# Altium schematic sheet martix_connect_2.SchDoc
size A4 portrait
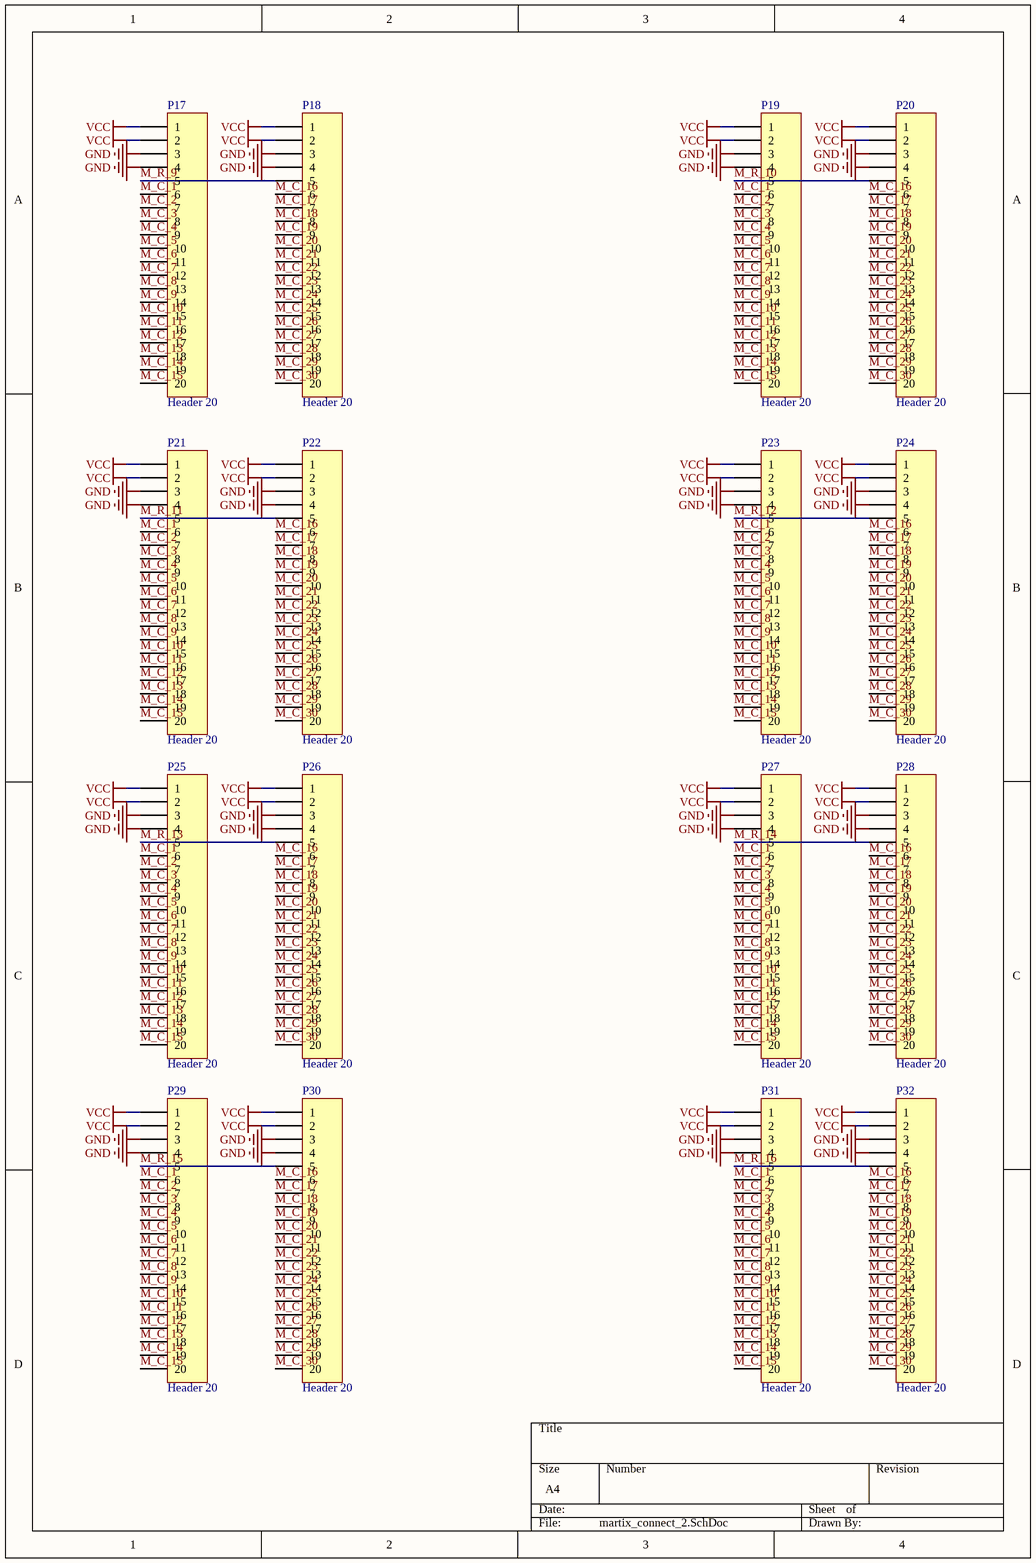
[diagram p0: martix_connect_2.SchDoc]

## Parts
P17  Header 20  [FPC0.5 2H-WS-20P]
P18  Header 20  [FPC0.5 2H-WS-20P]
P19  Header 20  [FPC0.5 2H-WS-20P]
P20  Header 20  [FPC0.5 2H-WS-20P]
P21  Header 20  [FPC0.5 2H-WS-20P]
P22  Header 20  [FPC0.5 2H-WS-20P]
P23  Header 20  [FPC0.5 2H-WS-20P]
P24  Header 20  [FPC0.5 2H-WS-20P]
P25  Header 20  [FPC0.5 2H-WS-20P]
P26  Header 20  [FPC0.5 2H-WS-20P]
P27  Header 20  [FPC0.5 2H-WS-20P]
P28  Header 20  [FPC0.5 2H-WS-20P]
P29  Header 20  [FPC0.5 2H-WS-20P]
P30  Header 20  [FPC0.5 2H-WS-20P]
P31  Header 20  [FPC0.5 2H-WS-20P]
P32  Header 20  [FPC0.5 2H-WS-20P]

## Nets
GND: P17.3 P17.4 P18.3 P18.4 P19.3 P19.4 P20.3 P20.4 P21.3 P21.4 P22.3 P22.4 P23.3 P23.4 P24.3 P24.4 P25.3 P25.4 P26.3 P26.4 P27.3 P27.4 P28.3 P28.4 P29.3 P29.4 P30.3 P30.4 P31.3 P31.4 P32.3 P32.4
VCC: P17.1 P17.2 P18.1 P18.2 P19.1 P19.2 P20.1 P20.2 P21.1 P21.2 P22.1 P22.2 P23.1 P23.2 P24.1 P24.2 P25.1 P25.2 P26.1 P26.2 P27.1 P27.2 P28.1 P28.2 P29.1 P29.2 P30.1 P30.2 P31.1 P31.2 P32.1 P32.2
M_C_1: P17.6 P19.6 P21.6 P23.6 P25.6 P27.6 P29.6 P31.6
M_C_2: P17.7 P19.7 P21.7 P23.7 P25.7 P27.7 P29.7 P31.7
M_C_3: P17.8 P19.8 P21.8 P23.8 P25.8 P27.8 P29.8 P31.8
M_C_4: P17.9 P19.9 P21.9 P23.9 P25.9 P27.9 P29.9 P31.9
M_C_5: P17.10 P19.10 P21.10 P23.10 P25.10 P27.10 P29.10 P31.10
M_C_6: P17.11 P19.11 P21.11 P23.11 P25.11 P27.11 P29.11 P31.11
M_C_7: P17.12 P19.12 P21.12 P23.12 P25.12 P27.12 P29.12 P31.12
M_C_8: P17.13 P19.13 P21.13 P23.13 P25.13 P27.13 P29.13 P31.13
M_C_9: P17.14 P19.14 P21.14 P23.14 P25.14 P27.14 P29.14 P31.14
M_C_10: P17.15 P19.15 P21.15 P23.15 P25.15 P27.15 P29.15 P31.15
M_C_11: P17.16 P19.16 P21.16 P23.16 P25.16 P27.16 P29.16 P31.16
M_C_12: P17.17 P19.17 P21.17 P23.17 P25.17 P27.17 P29.17 P31.17
M_C_13: P17.18 P19.18 P21.18 P23.18 P25.18 P27.18 P29.18 P31.18
M_C_14: P17.19 P19.19 P21.19 P23.19 P25.19 P27.19 P29.19 P31.19
M_C_15: P17.20 P19.20 P21.20 P23.20 P25.20 P27.20 P29.20 P31.20
M_C_16: P18.6 P20.6 P22.6 P24.6 P26.6 P28.6 P30.6 P32.6
M_C_17: P18.7 P20.7 P22.7 P24.7 P26.7 P28.7 P30.7 P32.7
M_C_18: P18.8 P20.8 P22.8 P24.8 P26.8 P28.8 P30.8 P32.8
M_C_19: P18.9 P20.9 P22.9 P24.9 P26.9 P28.9 P30.9 P32.9
M_C_20: P18.10 P20.10 P22.10 P24.10 P26.10 P28.10 P30.10 P32.10
M_C_21: P18.11 P20.11 P22.11 P24.11 P26.11 P28.11 P30.11 P32.11
M_C_22: P18.12 P20.12 P22.12 P24.12 P26.12 P28.12 P30.12 P32.12
M_C_23: P18.13 P20.13 P22.13 P24.13 P26.13 P28.13 P30.13 P32.13
M_C_24: P18.14 P20.14 P22.14 P24.14 P26.14 P28.14 P30.14 P32.14
M_C_25: P18.15 P20.15 P22.15 P24.15 P26.15 P28.15 P30.15 P32.15
M_C_26: P18.16 P20.16 P22.16 P24.16 P26.16 P28.16 P30.16 P32.16
M_C_27: P18.17 P20.17 P22.17 P24.17 P26.17 P28.17 P30.17 P32.17
M_C_28: P18.18 P20.18 P22.18 P24.18 P26.18 P28.18 P30.18 P32.18
M_C_29: P18.19 P20.19 P22.19 P24.19 P26.19 P28.19 P30.19 P32.19
M_C_30: P18.20 P20.20 P22.20 P24.20 P26.20 P28.20 P30.20 P32.20
M_R_9: P17.5 P18.5
M_R_10: P19.5 P20.5
M_R_11: P21.5 P22.5
M_R_12: P23.5 P24.5
M_R_13: P25.5 P26.5
M_R_14: P27.5 P28.5
M_R_15: P29.5 P30.5
M_R_16: P31.5 P32.5

## Library data of the parts
P17-P32 = Header 20: Header, 20-Pin; LatestRevisionDate: 17-Jul-2002; LatestRevisionNote: Re-released for DXP Platform.; Publisher: Altium Limited